# Altium project level_shifter.PrjPCB
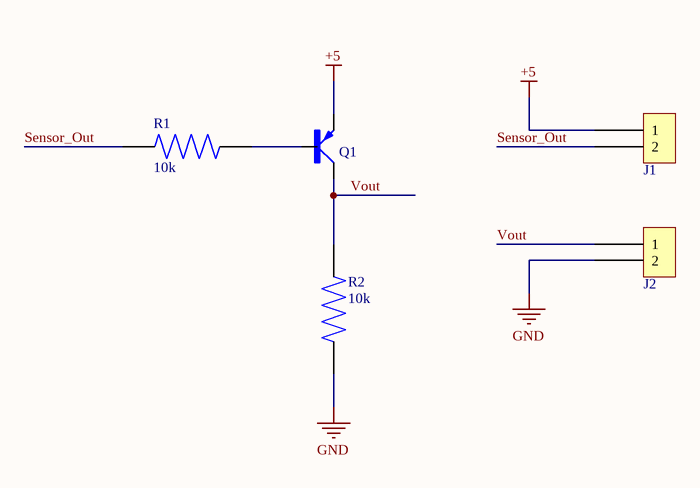
[diagram p0: level_shifter_sch.SchDoc]
1 sheet, 5 parts. Net scope: global (net labels, ports and power ports of the same name join across sheets).
Board file: level_shifter_pcb.PcbDoc

## Sheet level_shifter_sch.SchDoc
size A4

### Parts
J1  Terminal Block 1x2  [TERMINAL BLOCK 1X2]  (value not drawn)
J2  Terminal Block 1x2  [TERMINAL BLOCK 1X2]  (value not drawn)
Q1  BC327  [TO-92-3]  (value not drawn)
R1  value 10k  [THT RESISTOR]  (hidden comment: Resistor 10k)
R2  value 10k  [THT RESISTOR]  (hidden comment: Resistor 10k)

### Nets
+5: J1.1 Q1.E
GND: J2.2 R2.1
Sensor_Out: J1.2 R1.1
Vout: J2.1 Q1.C R2.2
NetQ1_B: Q1.B R1.2

### Library data of the parts
J1 J2 = Terminal Block 1x2: Fixed Terminal Block , screw type, 5.08 , horizontal, 2 poles, CUI Blue, slotted screw, PCB mount
Q1 = BC327: Bipolar (BJT) Transistor PNP 45V 800mA 100MHz 625mW Through Hole TO-92-3
R1 R2 = Resistor 10k: Carbon Film Resistor Through Hole 10k